# EAGLE schematic NE555_Arduino_interrupt_source (EAGLE 9.6.2)
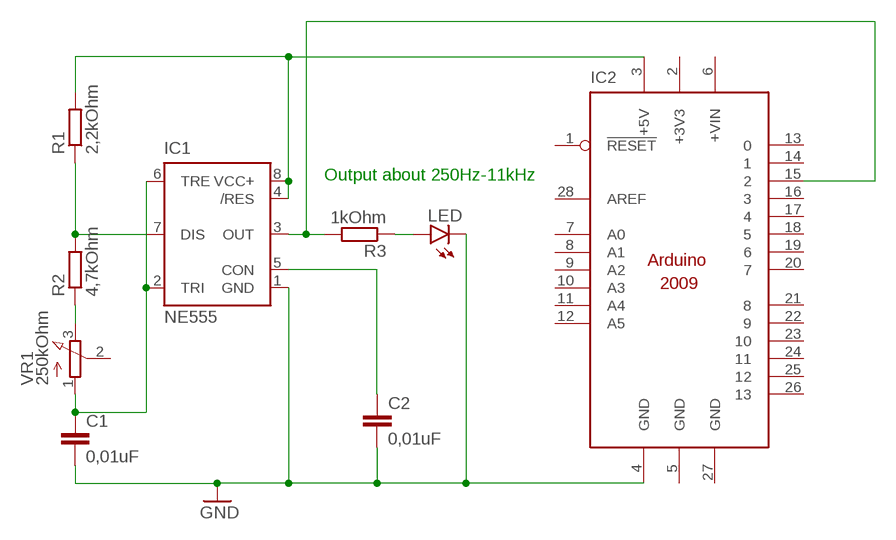
[diagram p0: schematic, sheet 1]

## Parts
C1  0,01uF  C2,5-3  [C2.5-3]
C2  0,01uF  C2,5-3  [C2.5-3]
IC1  NE555  [DIL-08]
IC2  ARDUINO2009_10  [ARDUINO2009]
LED  LED5MM  [LED5MM]
R1  2,2kOhm  R-EU_0204/2V  [0204V]
R2  4,7kOhm  R-EU_0204/2V  [0204V]
R3  1kOhm  R-EU_0204/2V  [0204V]
VR1  250kOhm  3RP/1610N  [3RP/1610N]

## Nets
GND: C1.2 C2.2 IC1.1(GND) IC2.4(GND) LED.K(C)
N$1: IC1.3(OUT) IC2.15 R3.2
N$2: LED.A R3.1
N$3: IC1.7(DIS) R1.1 R2.2
N$4: IC1.4(/RES) IC1.8(VCC+) IC2.3(+5V) R1.2
N$5: C2.1 IC1.5(CON)
N$6: R2.1 VR1.3(E)
N$7: C1.1 IC1.2(TRI) IC1.6(TRE) VR1.1(A)
Unconnected: IC2.1(!RESET) IC2.6(+VIN) IC2.7(A0) IC2.8(A1) IC2.9(A2) IC2.10(A3) IC2.11(A4) IC2.12(A5) IC2.13 IC2.14 IC2.16 IC2.17 IC2.18 IC2.19 IC2.20 IC2.21 IC2.22 IC2.23 IC2.24 IC2.25 IC2.26 IC2.28(AREF) VR1.2(S)

## Notes on the sheet
- Output about 250Hz-11kHz

## Power pins joined to a net without a drawn wire
+3V3: IC2.2(+3V3)
GND: IC2.5(GND) IC2.27(GND)

## Library data of the parts
C1 C2 = capacitor-wima:C: CAPACITOR naming: grid - package width
IC1 = st-microelectronics:NE555: General purpose bipolar Timer; MF: Arrow Electronics; MPN: NE555N; OC_FARNELL: 1467742; OC_NEWARK: 89K1486
IC2 = arduino:ARDUINO2009_1: The Arduino Duemilanove ("2009") is a microcontroller board based on the ATmega168 or ATmega328. - 14 digital input/output pins (of which 6 can be used as PWM outputs) - 6 analog inputs, a 16 MHz crystal oscillator - USB connection - power jack - ISP header - reset button It contains everything needed to support the microcontroller; simply connect it to a computer with a USB cable or power it with a AC-to-DC adapter or battery to get started http://arduino.cc/en/Main/ArduinoBoardDuemilanove
LED = led:LED: LED OSRAM: - CHIPLED LG R971, LG N971, LY N971, LG Q971, LY Q971, LO R971, LY R971 LH N974, LH R974 LS Q976, LO Q976, LY Q976 LO Q996 - Hyper CHIPLED LW Q18S LB Q993, LB Q99A, LB R99A - SideLED LS A670, LO A670, LY A670, LG A670, LP A670 LB A673, LV A673, LT A673, LW A673 LH A674 LY A675 LS A676, LA A676, LO A676, LY A676, LW A676 LS A679, LY A679, LG A679 - Hyper Micro SIDELED® LS Y876, LA Y876, LO Y876, LY Y876 LT Y87S - SmartLED LW L88C, LW L88S LB L89C, LB L89S, LG L890 LS L89K, LO L89K, LY L89K LS L896, LA L896, LO L896, LY L896 - TOPLED LS T670, LO T670, LY T670, LG T670, LP T670 LSG T670, LSP T670, LSY T670, LOP T670, LYG T670 LG T671, LOG T671, LSG T671 LB T673, LV T673, LT T673, LW T673 LH T674 LS T676, LA T676, LO T676, LY T676, LB T676, LH T676, LSB T676, LW T676 LB T67C, LV T67C, LT T67C, LS T67K, LO T67K, LY T67K, LW E67C LS E67B, LA E67B, LO E67B, LY E67B, LB E67C, LV E67C, LT E67C LW T67C LS T679, LY T679, LG T679 LS T770, LO T770, LY T770, LG T770, LP T770 LB T773, LV T773, LT T773, LW T773 LH T774 LS E675, LA E675, LY E675, LS T675 LS T776, LA T776, LO T776, LY T776, LB T776 LHGB T686 LT T68C, LB T68C - Hyper Mini TOPLED® LB M676 - Mini TOPLED Santana® LG M470 LS M47K, LO M47K, LY M47K Source: http://www.osram.convergy.de LUXEON: - LUMILED® LXK2-PW12-R00, LXK2-PW12-S00, LXK2-PW14-U00, LXK2-PW14-V00 LXK2-PM12-R00, LXK2-PM12-S00, LXK2-PM14-U00 LXK2-PE12-Q00, LXK2-PE12-R00, LXK2-PE12-S00, LXK2-PE14-T00, LXK2-PE14-U00 LXK2-PB12-K00, LXK2-PB12-L00, LXK2-PB12-M00, LXK2-PB14-N00, LXK2-PB14-P00, LXK2-PB14-Q00 LXK2-PR12-L00, LXK2-PR12-M00, LXK2-PR14-Q00, LXK2-PR14-R00 LXK2-PD12-Q00, LXK2-PD12-R00, LXK2-PD12-S00 LXK2-PH12-R00, LXK2-PH12-S00 LXK2-PL12-P00, LXK2-PL12-Q00, LXK2-PL12-R00 Source: www.luxeon.com KINGBRIGHT: KA-3528ASYC Source: www.kingbright.com
R1-R3 = rcl:R-EU_: RESISTOR, European symbol; SPICEPREFIX: R
VR1 = pot:3RP/1610N: 16mm Potentiometer one level Source: http://www.alphapotentiometers.net/html/16mm_pot_2.html